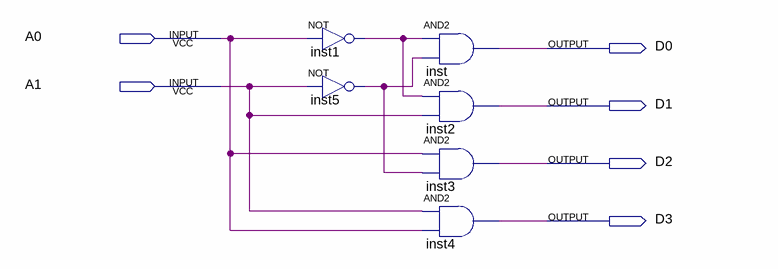
[diagram p0: schematic sheet]
// Quartus schematic decoder_2T04.bdf as structural Verilog: 6 symbols, 6 pins
module decoder_2T04 (
  input  A0,
  input  A1,
  output D0,
  output D1,
  output D2,
  output D3
);

  wire inst1_out, inst5_out;

  not inst1 (inst1_out, A0);
  not inst5 (inst5_out, A1);
  and inst (D0, inst1_out, inst5_out);
  and inst2 (D1, inst1_out, A1);
  and inst3 (D2, A0, inst5_out);
  and inst4 (D3, A1, A0);
endmodule
